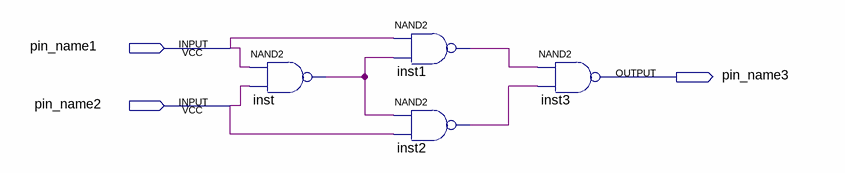
[diagram p0: schematic sheet]
// Quartus schematic my_xor.bdf as structural Verilog: 4 symbols, 3 pins
module my_xor (
  input  pin_name1,
  input  pin_name2,
  output pin_name3
);

  wire inst1_out, inst2_out, inst_out;

  nand inst (inst_out, pin_name1, pin_name2);
  nand inst1 (inst1_out, pin_name1, inst_out);
  nand inst2 (inst2_out, inst_out, pin_name2);
  nand inst3 (pin_name3, inst1_out, inst2_out);
endmodule
